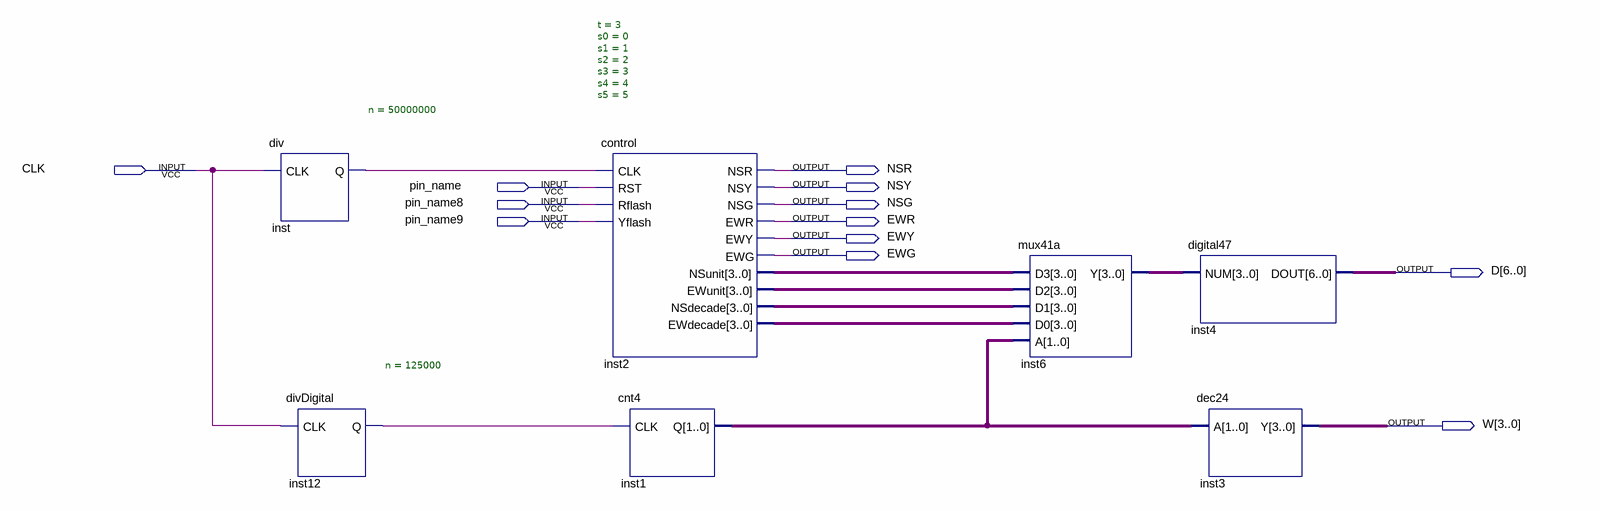
[diagram p0: schematic sheet]
// Quartus schematic fpga.bdf as structural Verilog: 7 symbols, 12 pins
module fpga (
  input  CLK,
  input  pin_name,
  input  pin_name8,
  input  pin_name9,
  output NSR,
  output NSY,
  output NSG,
  output EWR,
  output EWY,
  output EWG,
  output [6:0] D,
  output [3:0] W
);

  wire inst12_q, inst_q;
  wire [1:0] inst1_q;
  wire [3:0] inst2_ewdecade, inst2_ewunit, inst2_nsdecade, inst2_nsunit, inst6_y;

  div #(.n(50000000)) inst (.CLK(CLK), .Q(inst_q));
  divDigital #(.n(125000)) inst12 (.CLK(CLK), .Q(inst12_q));
  control #(.t(3), .s0(0), .s1(1), .s2(2), .s3(3), .s4(4), .s5(5)) inst2 (
    .CLK(inst_q), .RST(pin_name), .Rflash(pin_name8), .Yflash(pin_name9), .NSR(NSR), .NSY(NSY), .NSG(NSG),
    .EWR(EWR), .EWY(EWY), .EWG(EWG), .NSunit(inst2_nsunit), .EWunit(inst2_ewunit), .NSdecade(inst2_nsdecade),
    .EWdecade(inst2_ewdecade));
  cnt4 inst1 (.CLK(inst12_q), .Q(inst1_q));
  mux41a inst6 (
    .D3(inst2_nsunit), .D2(inst2_ewunit), .D1(inst2_nsdecade), .D0(inst2_ewdecade), .A(inst1_q), .Y(inst6_y));
  digital47 inst4 (.NUM(inst6_y), .DOUT(D));
  dec24 inst3 (.A(inst1_q), .Y(W));
endmodule
